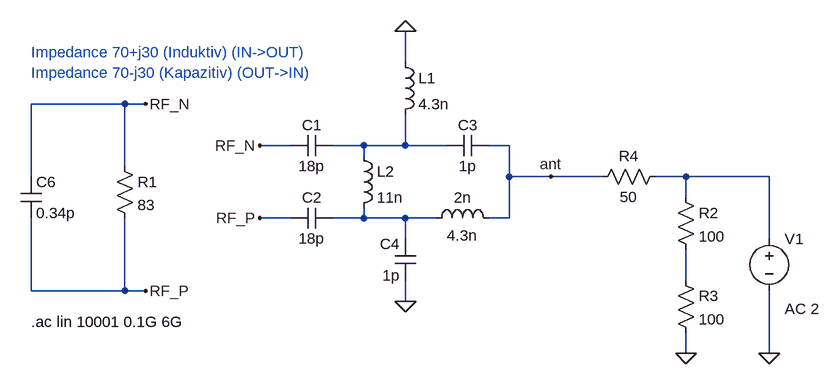
[diagram p0: schematic Antenne_2.4GHz_parallel.asc]
Antenne_2.4GHz_parallel.asc, the LTspice schematic file:
Version 4
SHEET 1 1300 1060
WIRE 240 48 240 0
WIRE -192 112 -336 112
WIRE -160 112 -192 112
WIRE 64 176 16 176
WIRE 176 176 128 176
WIRE 240 176 240 128
WIRE 240 176 176 176
WIRE 304 176 240 176
WIRE 400 176 368 176
WIRE 176 192 176 176
WIRE -192 208 -192 112
WIRE -336 224 -336 112
WIRE 400 224 400 176
WIRE 464 224 400 224
WIRE 544 224 464 224
WIRE 672 224 624 224
WIRE 800 224 672 224
WIRE 672 256 672 224
WIRE 64 288 16 288
WIRE 176 288 176 272
WIRE 176 288 128 288
WIRE 240 288 176 288
WIRE 288 288 240 288
WIRE 400 288 400 224
WIRE 400 288 368 288
WIRE 240 320 240 288
WIRE 800 320 800 224
WIRE 672 384 672 336
WIRE -336 400 -336 288
WIRE -192 400 -192 288
WIRE -192 400 -336 400
WIRE -160 400 -192 400
WIRE 240 416 240 384
WIRE 672 496 672 464
WIRE 800 496 800 400
FLAG 240 0 0
FLAG 16 176 RF_N
FLAG 16 288 RF_P
FLAG 464 224 ant
FLAG -160 112 RF_N
FLAG -160 400 RF_P
FLAG 240 416 0
FLAG 672 496 0
FLAG 800 496 0
SYMBOL cap 128 160 R90
WINDOW 0 0 32 VBottom 2
WINDOW 3 32 32 VTop 2
SYMATTR InstName C1
SYMATTR Value 18p
SYMBOL cap 128 272 R90
WINDOW 0 0 32 VBottom 2
WINDOW 3 32 32 VTop 2
SYMATTR InstName C2
SYMATTR Value 18p
SYMBOL cap 368 160 R90
WINDOW 0 0 32 VBottom 2
WINDOW 3 32 32 VTop 2
SYMATTR InstName C3
SYMATTR Value 1p
SYMBOL ind 224 32 R0
SYMATTR InstName L1
SYMATTR Value 4.3n
SYMBOL ind 272 304 R270
WINDOW 0 32 56 VTop 2
WINDOW 3 5 56 VBottom 2
SYMATTR InstName 2n
SYMATTR Value 4.3n
SYMBOL cap 256 384 R180
WINDOW 0 24 56 Left 2
WINDOW 3 24 8 Left 2
SYMATTR InstName C4
SYMATTR Value 1p
SYMBOL cap -352 224 R0
SYMATTR InstName C6
SYMATTR Value 0.34p
SYMBOL res 656 240 R0
SYMATTR InstName R2
SYMATTR Value 100
SYMBOL res 656 368 R0
SYMATTR InstName R3
SYMATTR Value 100
SYMBOL voltage 800 304 R0
WINDOW 123 24 124 Left 2
WINDOW 39 0 0 Left 2
SYMATTR Value2 AC 2
SYMATTR InstName V1
SYMATTR Value ""
SYMBOL res 640 208 R90
WINDOW 0 0 56 VBottom 2
WINDOW 3 32 56 VTop 2
SYMATTR InstName R4
SYMATTR Value 50
SYMBOL res -208 192 R0
SYMATTR InstName R1
SYMATTR Value 83
SYMBOL ind 160 176 R0
SYMATTR InstName L2
SYMATTR Value 11n
TEXT -336 32 Left 2 ;Impedance 70+j30 (Induktiv) (IN->OUT)
TEXT -336 64 Left 2 ;Impedance 70-j30 (Kapazitiv) (OUT->IN)
TEXT -336 448 Left 2 !.ac lin 10001 0.1G 6G

The netlist it stands for:
* Antenne_2.4GHz_parallel.asc
C1 N001 RF_N 18p
C2 N003 RF_P 18p
C3 ant N001 1p
L1 0 N001 4.3n
L§2n N003 ant 4.3n
C4 0 N003 1p
C6 RF_N RF_P 0.34p
R2 N002 N004 100
R3 N004 0 100
V1 N002 0 AC 2
R4 N002 ant 50
R1 RF_N RF_P 83
L2 N001 N003 11n
* Impedance 70+j30 (Induktiv) (IN->OUT)
* Impedance 70-j30 (Kapazitiv) (OUT->IN)
.ac lin 10001 0.1G 6G
.backanno
.end